# EAGLE design Delay.Chorus PT2399 MAIN v1.1 (EAGLE 7.7.0)
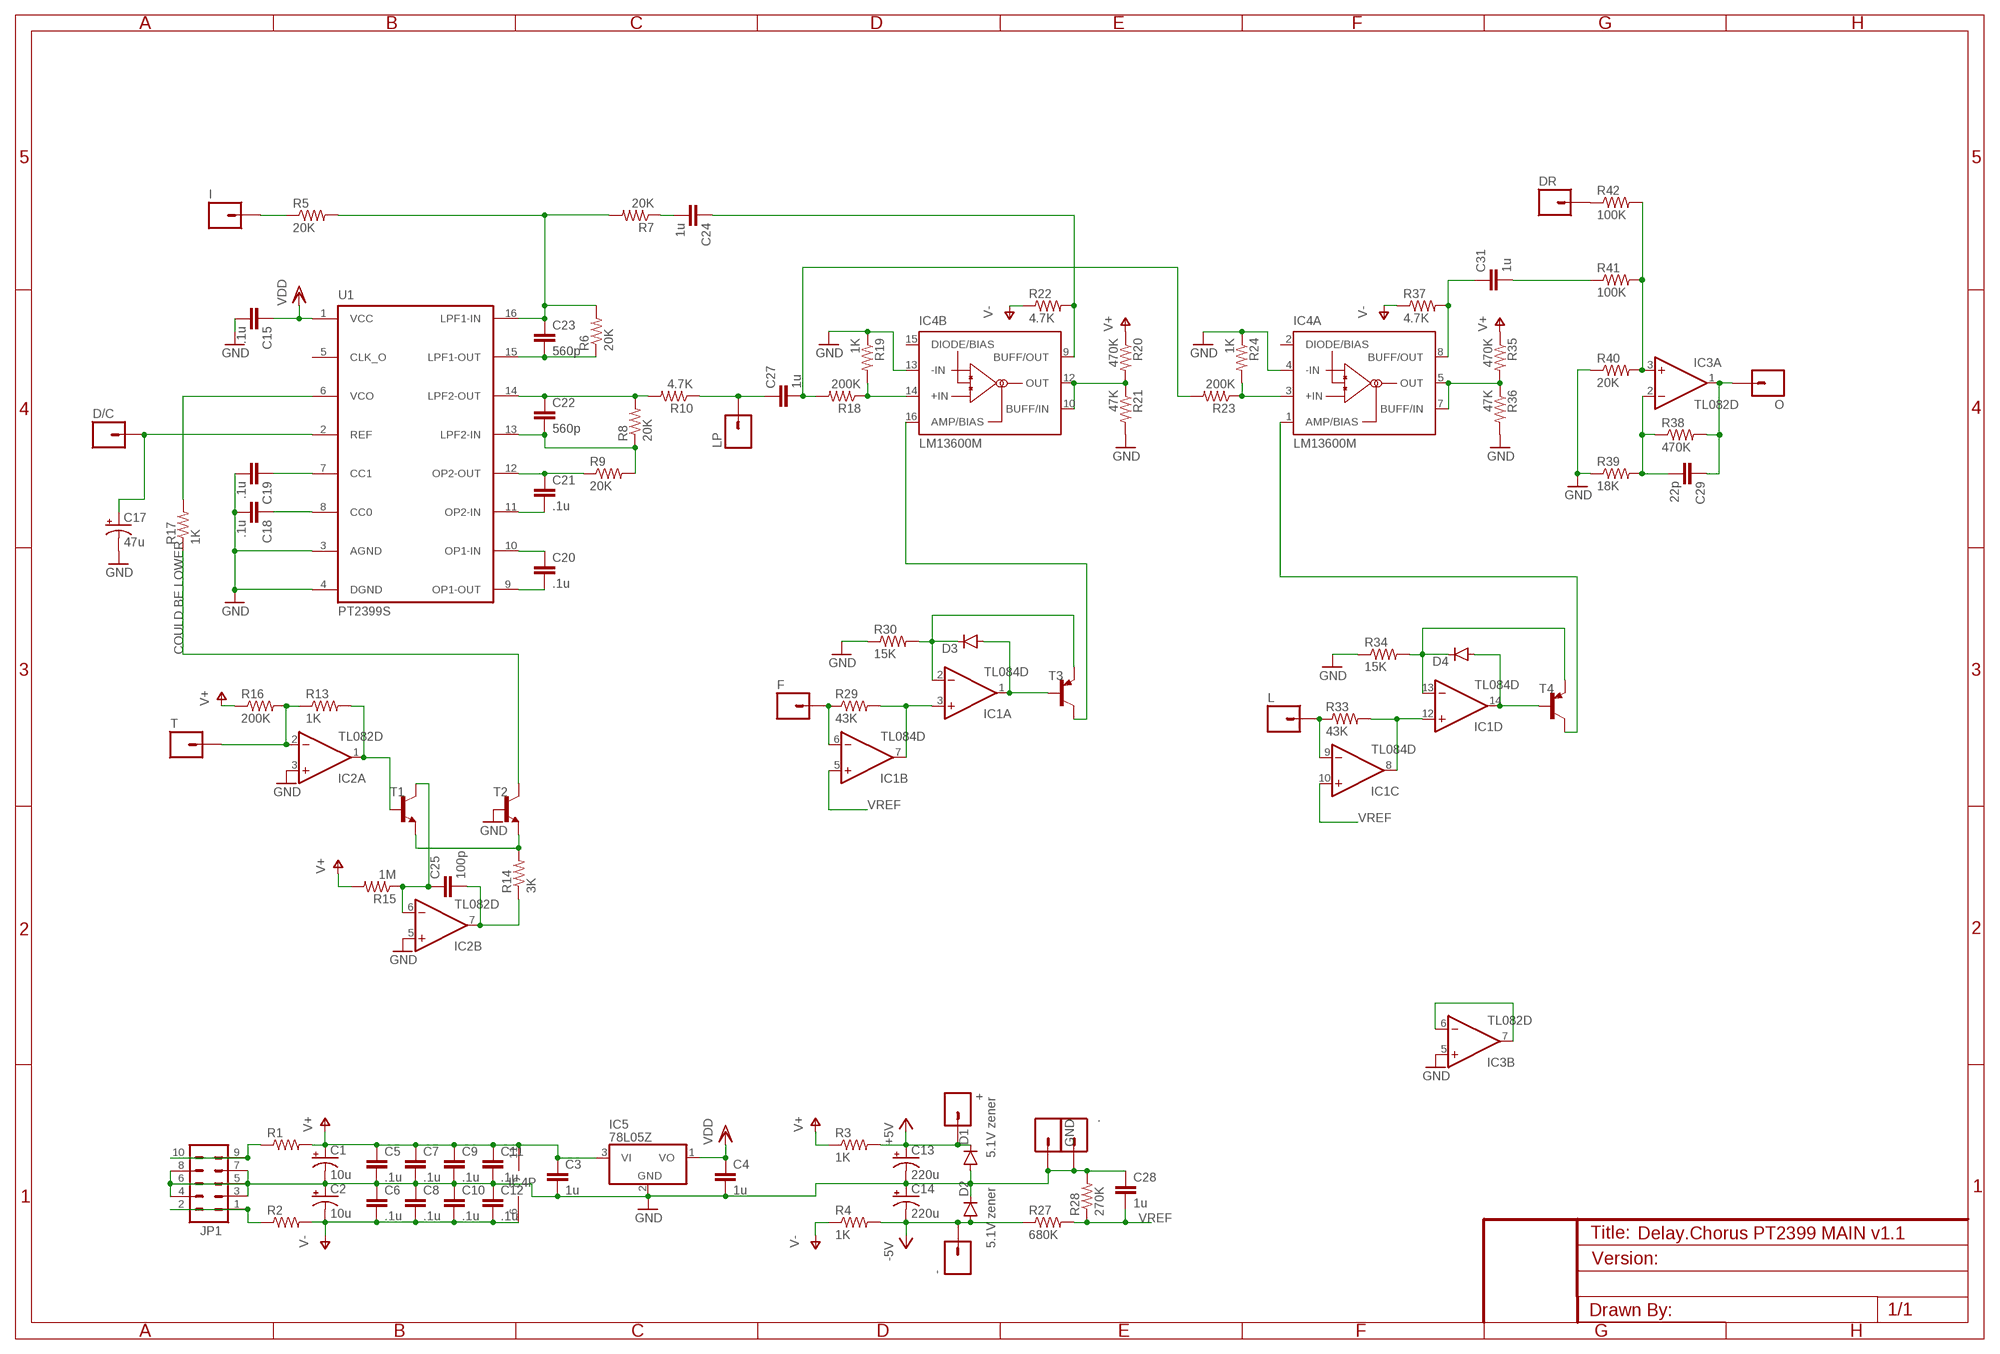
[diagram p0: schematic, sheet 1]

## Parts
+  M01PTH  [1X01]
-  M01PTH  [1X01]
.  M01PTH  [1X01]
C1  10u  CAP_POLPTH2  [CPOL-RADIAL-10UF-25V]
C2  10u  CAP_POLPTH2  [CPOL-RADIAL-10UF-25V]
C3  1u  CAP0805  [0805]
C4  1u  CAP0805  [0805]
C5  .1u  CAP0805  [0805]
C6  .1u  CAP0805  [0805]
C7  .1u  CAP0805  [0805]
C8  .1u  CAP0805  [0805]
C9  .1u  CAP0805  [0805]
C10  .1u  CAP0805  [0805]
C11  .1u  CAP0805  [0805]
C12  .1u  CAP0805  [0805]
C13  220u  CPOL-USE2.5-5  [E2,5-5]
C14  220u  CPOL-USE2.5-5  [E2,5-5]
C15  .1u  CAP0805  [0805]
C17  47u  CPOL-USE2.5-5  [E2,5-5]
C18  .1u  CAP0805  [0805]
C19  .1u  CAP0805  [0805]
C20  .1u  CAP0805  [0805]
C21  .1u  CAP0805  [0805]
C22  560p  CAP0805  [0805]
C23  560p  CAP0805  [0805]
C24  1u  CAP0805  [0805]
C25  100p  CAP0805  [0805]
C27  1u  CAP0805  [0805]
C28  1u  CAP0805  [0805]
C29  22p  CAP0805  [0805]
C31  1u  CAP0805  [0805]
D1  5.1V zener  DIODESOD123  [SOD-123]
D2  5.1V zener  DIODESOD123  [SOD-123]
D3  DIODESOD123  [SOD-123]
D4  DIODESOD123  [SOD-123]
D/C  M01PTH  [1X01]
DR  M01PTH  [1X01]
F  M01PTH  [1X01]
GND  M01PTH  [1X01]
I  M01PTH  [1X01]
IC1  TL084D  [SO14]
IC2  TL082D  [SO08]
IC3  TL082D  [SO08]
IC4  LM13600M  [SO16]
IC5  78L05Z  [TO92]
JP1  M05X2PTH  [AVR_ICSP]
L  M01PTH  [1X01]
LP  M01PTH  [1X01]
O  M01PTH  [1X01]
R1  RESISTOR0805-RES  [0805]
R2  RESISTOR0805-RES  [0805]
R3  1K  RESISTOR0805-RES  [0805]
R4  1K  RESISTOR0805-RES  [0805]
R5  20K  RESISTOR0805-RES  [0805]
R6  20K  RESISTOR0805-RES  [0805]
R7  20K  RESISTOR0805-RES  [0805]
R8  20K  RESISTOR0805-RES  [0805]
R9  20K  RESISTOR0805-RES  [0805]
R10  4.7K  RESISTOR0805-RES  [0805]
R13  1K  RESISTOR0805-RES  [0805]
R14  3K  RESISTOR0805-RES  [0805]
R15  1M  RESISTOR0805-RES  [0805]
R16  200K  RESISTOR0805-RES  [0805]
R17  1K  RESISTOR0805-RES  [0805]
R18  200K  RESISTOR0805-RES  [0805]
R19  1K  RESISTOR0805-RES  [0805]
R20  470K  RESISTOR0805-RES  [0805]
R21  47K  RESISTOR0805-RES  [0805]
R22  4.7K  RESISTOR0805-RES  [0805]
R23  200K  RESISTOR0805-RES  [0805]
R24  1K  RESISTOR0805-RES  [0805]
R27  680K  RESISTOR0805-RES  [0805]
R28  270K  RESISTOR0805-RES  [0805]
R29  43K  RESISTOR0805-RES  [0805]
R30  15K  RESISTOR0805-RES  [0805]
R33  43K  RESISTOR0805-RES  [0805]
R34  15K  RESISTOR0805-RES  [0805]
R35  470K  RESISTOR0805-RES  [0805]
R36  47K  RESISTOR0805-RES  [0805]
R37  4.7K  RESISTOR0805-RES  [0805]
R38  470K  RESISTOR0805-RES  [0805]
R39  18K  RESISTOR0805-RES  [0805]
R40  20K  RESISTOR0805-RES  [0805]
R41  100K  RESISTOR0805-RES  [0805]
R42  100K  RESISTOR0805-RES  [0805]
T  M01PTH  [1X01]
T1  MMBT3904LT1-NPN-SOT23-BEC  [SOT23-BEC]
T2  MMBT3904LT1-NPN-SOT23-BEC  [SOT23-BEC]
T3  MMBT3906LT1-PNP-SOT23-BEC  [SOT23-BEC]
T4  MMBT3906LT1-PNP-SOT23-BEC  [SOT23-BEC]
U1  PT2399S  [SO16W]

## Nets
+5V: +.1 C13.+ D1.C R3.2
-5V: -.1 C14.- D2.A R4.2 R27.1
GND: ..1 C1.2(-) C2.1(+) C3.2 C4.2 C5.2 C6.1 C7.2 C8.1 C9.2 C10.1 C11.2 C12.1 C13.- C14.+ C15.2 C17.- C18.2 C19.2 C28.1 D1.A D2.C GND.1 IC2.3(A:+IN) IC2.5(B:+IN) IC3.5(B:+IN) IC4.4(A:-IN) IC4.13(B:-IN) IC5.2(GND) JP1.3 JP1.4 JP1.5 JP1.6 JP1.7 JP1.8 R19.1 R21.2 R24.1 R28.2 R30.1 R34.1 R36.2 R39.1 R40.1 T2.B U1.3(AGND) U1.4(DGND)
N$1: C17.+ D/C.1 U1.2(REF)
N$2: C19.1 U1.7(CC1)
N$3: C18.1 U1.8(CC0)
N$4: C23.1 R5.2 R6.2 R7.2 U1.16(LPF1-IN)
N$5: C22.1 R8.2 R10.2 U1.14(LPF2-OUT)
N$6: C22.2 R8.1 R9.2 U1.13(LPF2-IN)
N$7: C21.1 R9.1 U1.12(OP2-OUT)
N$8: C21.2 U1.11(OP2-IN)
N$9: JP1.1 JP1.2 R2.1
N$10: JP1.9 JP1.10 R1.1
N$11: C20.1 U1.10(OP1-IN)
N$12: C20.2 U1.9(OP1-OUT)
N$13: C23.2 R6.1 U1.15(LPF1-OUT)
N$14: DR.1 R42.1
N$16: I.1 R5.1
N$17: C24.2 R7.1
N$18: C24.1 IC4.9(B:BUFF/OUT) R22.2
N$22: F.1 IC1.6(B:-IN) R29.1
N$23: IC2.2(A:-IN) R13.1 R16.2 T.1
N$24: IC2.1(A:OUT) R13.2 T1.B
N$25: R14.2 T1.E T2.E
N$26: C25.2 IC2.7(B:OUT) R14.1
N$27: C25.1 IC2.6(B:-IN) R15.1 T1.C
N$28: C27.2 R18.2 R23.2
N$29: R17.1 T2.C
N$30: R17.2 U1.6(VCO)
N$31: IC4.14(B:+IN) R18.1 R19.2
N$32: IC4.10(B:BUFF/IN) IC4.12(B:OUT) R20.2 R21.1
N$34: IC4.3(A:+IN) R23.1 R24.2
N$38: IC1.3(A:+IN) IC1.7(B:OUT) R29.2
N$39: D3.C IC1.2(A:-IN) R30.2 T3.E
N$40: D3.A IC1.1(A:OUT) T3.B
N$41: IC4.5(A:OUT) IC4.7(A:BUFF/IN) R35.2 R36.1
N$42: IC4.16(B:AMP/BIAS) T3.C
N$47: IC1.8(C:OUT) IC1.12(D:+IN) R33.2
N$48: D4.C IC1.13(D:-IN) R34.2 T4.E
N$49: D4.A IC1.14(D:OUT) T4.B
N$50: IC4.1(A:AMP/BIAS) T4.C
N$51: C31.1 IC4.8(A:BUFF/OUT) R37.2
N$52: C29.2 IC3.2(A:-IN) R38.1 R39.2
N$53: C29.1 IC3.1(A:OUT) O.1 R38.2
N$54: IC1.9(C:-IN) L.1 R33.1
N$55: IC3.3(A:+IN) R40.2 R41.2 R42.2
N$56: C31.2 R41.1
N$59: IC3.6(B:-IN) IC3.7(B:OUT)
N$62: C27.1 LP.1 R10.1
V+: C1.1(+) C3.1 C5.1 C7.1 C9.1 C11.1 IC4.11(P:V+) IC5.3(VI) R1.2 R3.1 R15.2 R16.1 R20.1 R35.1
V-: C2.2(-) C6.2 C8.2 C10.2 C12.2 IC4.6(P:V-) R2.2 R4.1 R22.1 R37.1
VDD: C4.1 C15.1 IC5.1(VO) U1.1(VCC)
VREF: C28.2 IC1.5(B:+IN) IC1.10(C:+IN) R27.2 R28.1
Unconnected: IC4.2(A:DIODE/BIAS) IC4.15(B:DIODE/BIAS) U1.5(CLK_O)

## Notes on the sheet
- COULD BE LOWER

## Power pins joined to a net without a drawn wire
V+: IC1.4(P:V+) IC2.8(P:V+) IC3.8(P:V+)
V-: IC1.11(P:V-) IC2.4(P:V-) IC3.4(P:V-)

## Library data of the parts
+ - . D/C DR F GND I L LP O T = SparkFun-Connectors:M01: Header 1 Standard 1-pin 0.1" header. Use with straight break away headers (SKU : PRT-00116), right angle break away headers (PRT-00553), swiss pins (PRT-00743), machine pins (PRT-00117), and female headers (PRT-00115).
C1 C2 = SparkFun-Capacitors:CAP_POL: Capacitor Polarized These are standard SMD and PTH capacitors. Normally 10uF, 47uF, and 100uF in electrolytic and tantalum varieties. Always verify the external diameter of the through hole cap, it varies with capacity, voltage, and manufacturer. The EIA devices should be standard.
C3-C12 C15 C18-C25 C27-C29 C31 = SparkFun-Capacitors:CAP: Capacitor Standard 0603 ceramic capacitor, and 0.1" leaded capacitor.
C13 C14 C17 = rcl:CPOL-US: POLARIZED CAPACITOR, American symbol
D1-D4 = SparkFun-DiscreteSemi:DIODE: Diode These are standard reverse protection diodes and small signal diodes. SMA package can handle up to about 1A. SOD-323 can handle about 200mA. What the SOD-323 package when ordering, there are some mfgs out there that are 5-pin packages.
IC1 = linear:TL084: OP AMP
IC2 IC3 = linear:TL082: OP AMP Data sheet <http://www.ti.com/lit/ds/symlink/tl084a . pdf>; DATA_SHEET: <a href="http://www.ti.com/lit/ds/symlink/tl084a.pdf"> Data sheet </a>
IC4 = national-semiconductor:LM13600: Dual Operational Transconductance Amplifiers with Linearizing Diodes and Buffers Source: lm13600.PDF
IC5 = linear:78*: Positive VOLTAGE REGULATOR Source: http://cache.national.com/ds/LM/LM78L05.pdf http://www.fairchildsemi.com/ds/LM/LM7805.pdf
JP1 = SparkFun-Connectors:M05X2: Header 5x2 Standard 10-pin dual row 0.1" header. Commonly used with AVR-ISP. Use with Spark Fun Electronics SKU: PRT-00778
R1-R10 R13-R24 R27-R30 R33-R42 = SparkFun-Passives:RESISTOR: Resistor Basic schematic elements and footprints for 0603, 1206, and PTH resistors.
T1 T2 = transistor:*-NPN-: NPN Transistror BF959 corrected 2008.03.06
T3 T4 = transistor:*-PNP-: PNP Transistror
U1 = princeton-tech:PT2399: Echo Processor IC

## Board
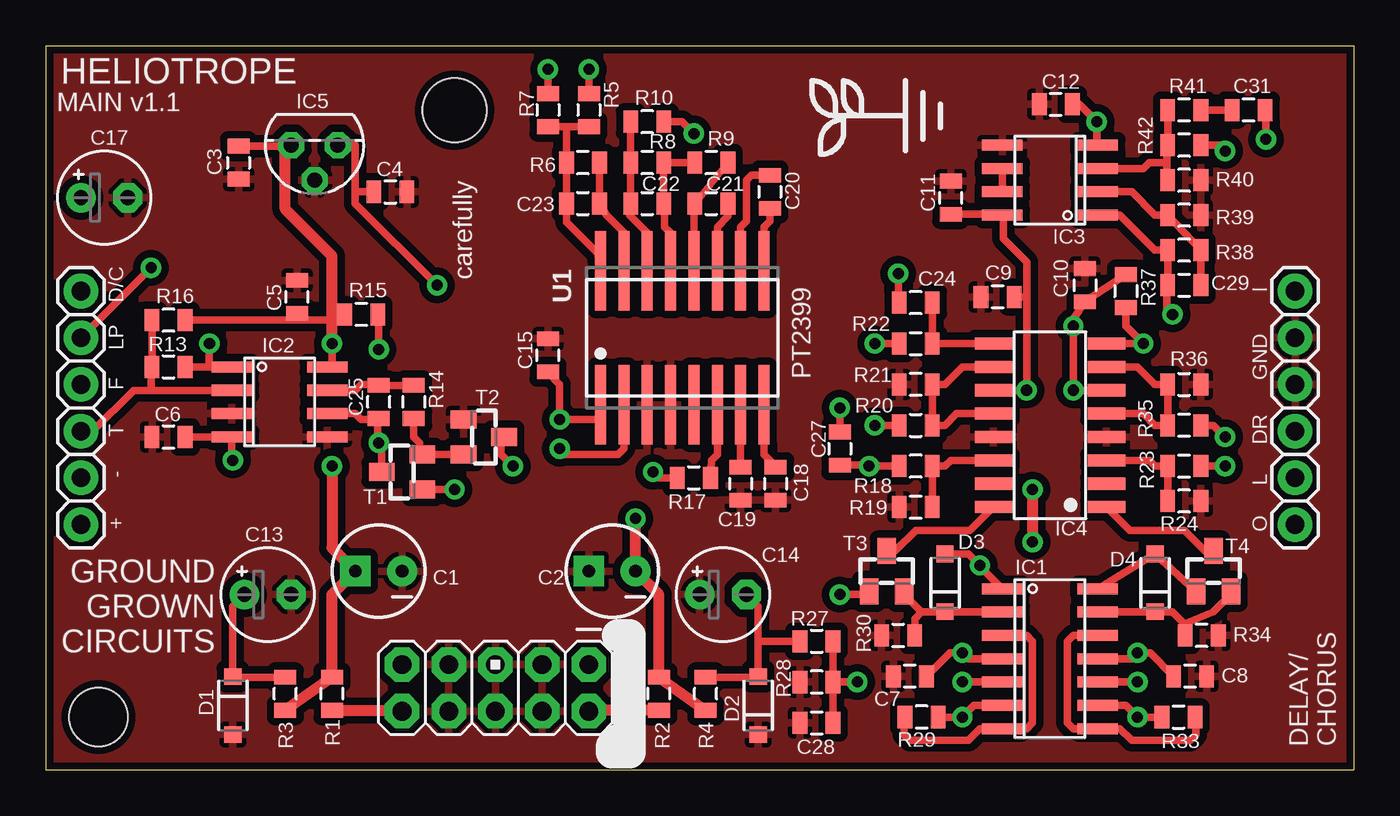
[diagram p1: board, top side]
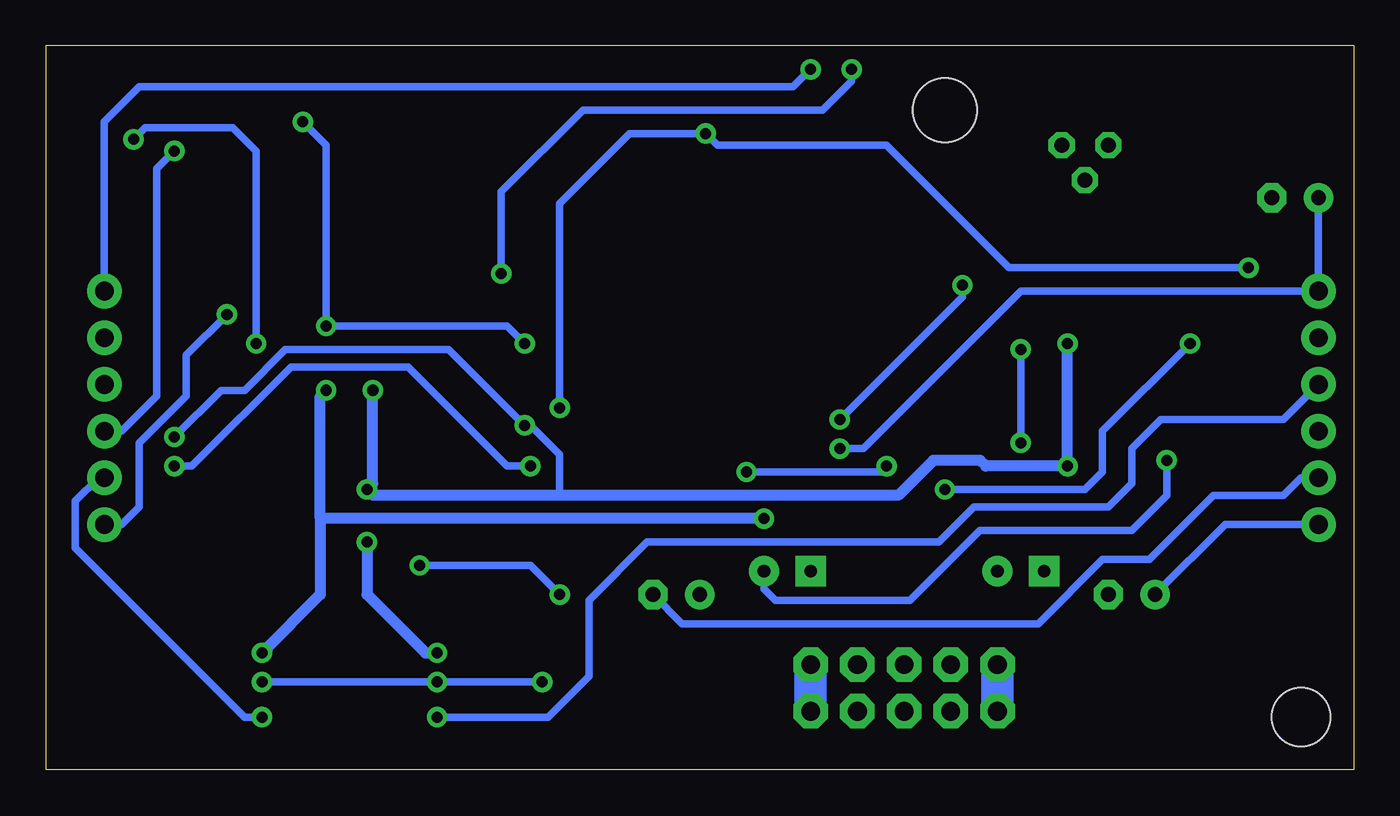
[diagram p2: board, bottom side, seen from below]

Size 71.12 x 39.37 mm. Coordinates in mm from the lower left corner, seen from the top.
Outline: 0,0 71.12,0 71.12,39.37 0,39.37 0,0
Copper layers (1*16): Top 0.035mm / dielectric 1.5mm / Bottom 0.035mm
Design rules "SparkFun": minimum track width 8mil, minimum drill 20mil, track to track 8mil, track to pad 8mil, pad to pad 8mil, via to via 8mil, smd to smd 8mil, copper to edge 8mil, drill to drill 8mil, minimum pad ring 12mil, minimum via ring 10mil, stop-mask expansion 4mil, vias tented up to drill 20mil, thermal gap 10mil
Holes 3.5 mm at 22.23,35.88
Holes 3.2 mm at 2.86,2.86

### Footprints (pad centres in the part's own frame; a part is rotated, then mirrored left to right if it is on the bottom)
1X01 = drill 1.016 pad 1.88: 1 0,0
CPOL-RADIAL-10UF-25V = drill 0.7 pad 1.651 square: 1 1.27,0 | drill 0.7 pad 1.651: 2 -1.27,0
0805 = smd 0.8 x 1.2: 1 -0.9,0; 2 0.9,0
E2,5-5 = drill 0.813 pad 1.6: + -1.27,0 | drill 0.813 pad 1.6 octagon: - 1.27,0
SOD-123 = smd 0.9 x 0.95: A 1.575,0; C -1.575,0
SO14 = smd 0.6 x 2.2: 1 -3.81,-2.6; 2 -2.54,-2.6; 3 -1.27,-2.6; 4 0,-2.6; 5 1.27,-2.6; 6 2.54,-2.6; 7 3.81,-2.6; 8 3.81,2.6; 9 2.54,2.6; 10 1.27,2.6; 11 0,2.6; 12 -1.27,2.6; 13 -2.54,2.6; 14 -3.81,2.6
SO08 = smd 0.6 x 2.2: 1 -1.905,-2.6; 2 -0.635,-2.6; 3 0.635,-2.6; 4 1.905,-2.6; 5 1.905,2.6; 6 0.635,2.6; 7 -0.635,2.6; 8 -1.905,2.6
SO16 = smd 0.66 x 2.032: 1 -4.445,-3.073; 2 -3.175,-3.073; 3 -1.905,-3.073; 4 -0.635,-3.073; 5 0.635,-3.073; 6 1.905,-3.073; 7 3.175,-3.073; 8 4.445,-3.073; 9 4.445,3.073; 10 3.175,3.073; 11 1.905,3.073; 12 0.635,3.073; 13 -0.635,3.073; 14 -1.905,3.073; 15 -3.175,3.073; 16 -4.445,3.073
TO92 = drill 0.813 octagon: 1 -1.27,0; 2 0,1.905; 3 1.27,0
AVR_ICSP = drill 1.016 pad 1.88 octagon: 1 -1.27,5.08; 2 1.27,5.08; 3 -1.27,2.54; 4 1.27,2.54; 5 -1.27,0; 6 1.27,0; 7 -1.27,-2.54; 8 1.27,-2.54; 9 -1.27,-5.08; 10 1.27,-5.08
SOT23-BEC = smd 1 x 1.4: B -0.95,-1.1; C 0,1.1; E 0.95,-1.1
SO16W = smd 0.6 x 4.318: 1 -4.445,-3.647; 2 -3.175,-3.647; 3 -1.905,-3.647; 4 -0.635,-3.647; 5 0.635,-3.647; 6 1.905,-3.647; 7 3.175,-3.647; 8 4.445,-3.647; 9 4.445,3.647; 10 3.175,3.647; 11 1.905,3.647; 12 0.635,3.647; 13 -0.635,3.647; 14 -1.905,3.647; 15 -3.175,3.647; 16 -4.445,3.647

### Placement (x,y rotation side)
+  1.91,13.34 270 top
-  1.91,15.88 270 top
.  67.94,23.5 90 top
C1  18.1,10.79 180 top
C2  30.8,10.79 180 top
C3  10.48,33.02 270 top
C4  18.73,31.43 0 top
C5  13.65,25.72 90 top
C6  6.67,18.1 0 top
C7  46.99,5.08 180 top
C8  62.23,5.08 180 top
C9  51.75,25.72 180 top
C10  56.52,26.35 270 top
C11  49.21,31.11 90 top
C12  54.93,36.2 0 top
C13  12.06,9.53 0 top
C14  36.83,9.53 0 top
C15  27.3,22.54 90 top
C17  3.17,31.11 0 top
C18  39.69,15.56 270 top
C19  37.78,15.56 270 top
C20  39.37,31.43 270 top
C21  36.2,30.8 0 top
C22  32.7,30.8 0 top
C23  29.21,30.8 0 top
C24  47.31,25.4 180 top
C25  18.1,20 90 top
C27  43.18,17.46 270 top
C28  41.91,2.54 0 top
C29  61.91,26.35 0 top
C31  65.41,35.88 180 top
D1  10.16,3.49 270 top
D2  38.73,3.49 90 top
D3  48.9,10.16 90 top
D4  60.33,10.16 90 top
D/C  1.91,26.04 270 top
DR  67.94,18.41 90 top
F  1.91,20.95 270 top
GND  67.94,20.95 90 top
I  67.94,26.04 90 top
IC1  54.61,6.03 270 top
IC2  12.7,20 270 top
IC3  54.61,32.07 90 top
IC4  54.61,18.73 90 top
IC5  14.61,33.97 180 top
JP1  24.45,4.45 270 top
L  67.94,15.88 90 top
LP  1.91,23.5 270 top
O  67.94,13.34 90 top
R1  15.56,4.13 90 top
R2  33.34,4.13 90 top
R3  13.02,4.13 90 top
R4  35.88,4.13 90 top
R5  29.53,35.88 270 top
R6  29.21,33.02 180 top
R7  27.3,35.88 270 top
R8  32.7,33.02 180 top
R9  36.2,33.02 180 top
R10  32.7,35.24 180 top
R13  6.67,21.91 0 top
R14  20,20 270 top
R15  17.14,24.77 180 top
R16  6.67,24.45 180 top
R17  35.24,15.88 0 top
R18  47.31,16.51 180 top
R19  47.31,14.29 0 top
R20  47.31,18.73 0 top
R21  47.31,20.95 180 top
R22  47.31,23.18 0 top
R23  61.91,16.51 0 top
R24  61.91,14.61 180 top
R27  41.91,6.99 0 top
R28  41.91,4.76 180 top
R29  47.62,2.86 180 top
R30  46.35,7.3 0 top
R33  61.59,2.86 0 top
R34  62.87,7.3 180 top
R35  61.91,18.73 180 top
R36  61.91,20.95 0 top
R37  58.74,26.04 270 top
R38  61.91,28.26 180 top
R39  61.91,30.16 180 top
R40  61.91,32.07 180 top
R41  61.91,35.88 180 top
R42  61.91,33.97 180 top
T  1.91,18.41 270 top
T1  19.37,16.19 90 top
T2  23.81,18.1 270 top
T3  45.72,10.79 0 top
T4  63.5,10.79 0 top
U1  34.61,23.5 0 top
U$1  [LOGO_SMALL]  46.67,35.56 90 top

### Tracks (layer width: path | path; a pad name or v marks a point on that pad's centre or on a via)
+5V
  Top 0.406: R3.2 10.2,5.03 D1.C 10.16,8.89 C13.+
  Bottom 0.406: +.1 6.99,13.34 C13.+
-5V
  Top 0.406: R4.2 38.7,5.03 D2.A 38.73,6.99 | 38.73,6.99 38.73,8.89 C14.- | R27.1 38.73,6.99
  Bottom 0.406: -.1 2.86,15.88 3.81,14.92 7.62,14.92 11.11,11.43 13.65,11.43 17.14,7.94 36.51,7.94 C14.-
GND
  pour Top (isolate 0.406): 0,0 0,39.37 71.12,39.37 71.12,0
N$1  (via drill 0.6)
  Top 0.406: v27.94,17.46 28.26,17.14 31.11,17.14 31.43,17.46 U1.2
  Bottom 0.406: C17.+ D/C.1 18.1,26.04 26.67,17.46 v27.94,17.46
N$2
  Top 0.406: C19.1 U1.7
N$3
  Top 0.406: C18.1 39.69,16.51 39.05,17.14 U1.8
N$4
  Top 0.406: R5.2 28.26,34.98 | 28.26,34.98 R7.2 | 28.26,34.98 28.31,34.92 R6.2 C23.1 28.31,29.79 30.01,28.09 U1.16
N$5
  Top 0.406: R10.2 R8.2 C22.1 31.75,30.75 31.75,30.16 32.7,29.21 U1.14
N$6
  Top 0.406: R9.2 R8.1 C22.2 33.66,30.75 33.66,29.53 33.97,29.21 U1.13
N$7
  Top 0.406: R9.1 C21.1 35.24,30.75 U1.12
N$8
  Top 0.406: C21.2 37.09,30.11 36.51,29.53 U1.11
N$9
  Top 0.61: R2.1 29.53,3.23 JP1.2
  Bottom 1.778: JP1.1 JP1.2
N$10
  Top 0.61: R1.1 19.37,3.23 JP1.10
  Bottom 1.778: JP1.9 JP1.10
N$11
  Top 0.406: C20.1 38.37,32.33 38.1,32.07 38.1,29.84 37.78,29.53 U1.10
N$12
  Top 0.406: C20.2 39.37,29.84 39.05,29.53 U1.9
N$13
  Top 0.406: R6.1 C23.2 30.48,30.16 31.43,29.21 U1.15
N$14  (via drill 0.6)
  Top 0.406: R42.1 63.82,33.97 v64.14,33.66
  Bottom 0.406: v64.14,33.66 65.09,32.7 65.09,20.32 66.99,18.41 DR.1
N$16  (via drill 0.6)
  Top 0.406: v29.53,38.1 R5.1
  Bottom 0.406: I.1 67.94,35.24 66.04,37.15 30.48,37.15 v29.53,38.1
N$17  (via drill 0.6)
  Top 0.406: R7.1 v27.3,38.1 | v46.35,26.99 46.35,25.45 C24.2
  Bottom 0.406: v27.3,38.1 27.3,37.47 28.89,35.88 41.91,35.88 46.35,31.43 v46.35,26.99
N$18
  Top 0.406: IC4.9 R22.2 C24.1
N$22  (via drill 0.6)
  Top 0.406: IC1.6 50.48,3.49 v49.85,2.86 R29.1
  Bottom 0.406: v49.85,2.86 43.81,2.86 41.59,5.08 41.59,9.21 38.42,12.38 22.54,12.38 20.64,14.29 13.34,14.29 12.06,15.56 12.06,17.46 10.48,19.05 3.81,19.05 F.1
N$23
  Top 0.406: IC2.2 5.71,20.64 | 5.71,20.64 5.71,21.86 R13.1 R16.2 | T.1 2.54,18.41 4.76,20.64 5.71,20.64
N$24  (via drill 0.6)
  Top 0.406: R13.2 8.89,21.91 | 8.89,21.91 IC2.1 | T1.B v22.22,15.24 v22.23,15.24 | v8.89,23.18 8.89,21.91
  Bottom 0.406: v22.23,15.24 14.61,15.24 13.65,16.19 13.65,18.41 v8.89,23.18
N$25
  Top 0.406: R14.2 20,18.1 20.32,17.78 20.32,17.29 T1.E T2.E
N$26
  Top 0.406: IC2.7 16.83,20.64 17.14,20.95 18.05,20.95 C25.2 R14.1
N$27  (via drill 0.6)
  Top 0.406: IC2.6 16.83,19.37 17.14,19.05 18.05,19.05 | 18.05,19.05 C25.1 | T1.C 18.27,17.61 v18.1,17.78 18.05,17.83 18.05,19.05 | v18.1,22.86 18.1,24.39 R15.1
  Bottom 0.406: v18.1,17.78 v18.1,22.86
N$28  (via drill 0.6)
  Top 0.406: C27.2 44.72,16.56 v44.77,16.51 R18.2 | v64.14,16.51 R23.2
  Bottom 0.406: v44.77,16.51 46.04,16.51 51.44,21.91 57.78,21.91 63.18,16.51 v64.14,16.51
N$29  (via drill 0.6)
  Top 0.406: R17.1 33.34,15.88 v33.02,16.19 | v25.4,16.51 24.77,17.14 24.77,17.95 T2.C
  Bottom 0.406: v33.02,16.19 25.72,16.19 v25.4,16.51
N$30
  Top 0.406: R17.2 36.2,16.83 36.51,17.14 U1.6
N$31
  Top 0.406: IC4.14 49.21,16.83 48.9,16.51 R18.1 R19.2
N$32
  Top 0.406: IC4.12 49.53,19.37 48.9,18.73 R20.2 R21.1 48.9,20.95 49.85,21.91 IC4.10
N$34
  Top 0.406: IC4.3 60.01,16.83 60.33,16.51 R23.1 R24.2
N$38
  Top 0.406: IC1.3 53.34,7.3 53.66,6.99 53.66,2.54 53.34,2.22 IC1.7 50.8,2.22 50.16,1.59 46.99,1.59 46.67,1.91 46.67,2.81 R29.2
N$39
  Top 0.406: T3.E 46.67,9.53 47.62,8.57 | 47.62,8.57 48.88,8.57 D3.C 52,8.59 IC1.2 | R30.2 47.26,8.2 47.62,8.57
N$40  (via drill 0.6)
  Top 0.406: D3.A 50.18,11.73 v50.8,11.11 50.8,11.05 IC1.1 | v43.18,9.53 44.6,9.53 T3.B
  Bottom 0.406: v50.8,11.11 44.77,11.11 v43.18,9.53
N$41
  Top 0.406: IC4.5 59.69,19.37 60.33,18.73 R35.2 R36.1 60.33,20.95 59.37,21.91 IC4.7
N$42
  Top 0.406: T3.C 46.19,11.89 47.31,13.02 50.27,13.02 IC4.16
N$47
  Top 0.406: R33.2 62.55,2.81 62.55,1.91 62.23,1.59 59.05,1.59 58.42,2.22 IC1.8 55.88,2.22 55.56,2.54 55.56,6.99 55.88,7.3 IC1.12
N$48
  Top 0.406: IC1.13 60.31,8.57 D4.C 60.34,8.57 61.28,8.57 61.91,7.94 | R34.2 61.97,7.88 61.91,7.94 | T4.E 64.45,9.52 63.5,8.57 61.91,7.94
N$49
  Top 0.406: T4.B D4.A IC1.14
N$50
  Top 0.406: T4.C 63.03,11.89 61.91,13.02 58.95,13.02 IC4.1
N$51  (via drill 0.6)
  Top 0.406: IC4.8 v59.69,23.18 58.74,24.13 R37.2 | v66.36,34.29 66.36,35.83 C31.1
  Bottom 0.406: v59.69,23.18 59.69,33.66 60.96,34.92 65.72,34.92 v66.36,34.29
N$52
  Top 0.406: IC3.2 59.05,31.43 60.33,30.16 R39.2 R38.1 C29.2
N$53  (via drill 0.6)
  Top 0.406: IC3.1 58.42,30.16 60.33,28.26 R38.2 C29.1 60.96,26.3 60.96,25.08 v61.28,24.77
  Bottom 0.406: O.1 66.99,13.34 66.04,14.29 66.04,17.78 63.5,20.32 63.5,22.54 v61.28,24.77
N$54  (via drill 0.6)
  Top 0.406: R33.1 v59.37,2.86 58.74,3.49 IC1.9
  Bottom 0.406: L.1 68.26,15.88 69.53,14.61 69.53,12.06 60.33,2.86 v59.37,2.86
N$55
  Top 0.406: IC3.3 59.69,32.7 60.01,33.02 60.96,33.02 | 60.96,33.02 60.96,32.12 R40.2 | 60.96,33.02 60.96,33.92 R42.2 R41.2
N$56
  Top 0.406: R41.1 C31.2
N$59
  Top 0.406: IC3.6 IC3.7
N$62  (via drill 0.6)
  Top 0.406: LP.1 v5.71,27.3 | R10.1 34.61,35.24 v35.24,34.61 | v43.18,19.68 C27.1
  Bottom 0.406: v43.18,19.68 43.18,30.8 39.37,34.61 v35.24,34.61 34.61,33.97 25.4,33.97 18.73,27.3 v5.71,27.3
V+  (via drill 0.6)
  Top 0.406: IC2.8 15.56,22.16 v15.56,23.18 | R16.1 13.65,24.45 | C5.1 13.65,24.45 | 13.65,24.45 15.56,24.45 | R15.2 15.56,24.77 | C3.1 13.28,33.92 IC5.3 | IC1.4 50.16,6.03 v49.85,6.35 49.16,6.35 C7.1 | IC4.11 v53.34,20.64 53.34,25.72 | R20.1 v45.09,18.73 | 53.34,25.72 53.34,27.62 52.07,28.89 52.07,30.1 IC3.8 51.96,30.21 C11.1 | C9.1 53.34,25.72 | R35.1 63.5,18.73 v64.14,18.1
  Top 0.61: R3.1 R1.2 15.56,9.53 C1.1 15.56,12.06 v15.56,16.51 | v15.56,23.18 15.56,24.45 15.56,24.77 15.56,27.94 13.02,30.48 13.02,33.66 IC5.3 | v53.66,15.24 v53.66,12.38
  Bottom 0.406: 43.18,14.92 43.18,17.14 44.77,18.73 v45.09,18.73 49.21,22.86 58.1,22.86 60.33,20.64 61.59,20.64 v64.14,18.1
  Bottom 0.61: v53.66,12.38 53.66,9.53 50.48,6.35 v49.85,6.35 | v53.34,20.64 53.34,15.56 v53.66,15.24 53.34,14.92 43.18,14.92 24.77,14.92 22.86,16.83 20.32,16.83 20,16.51 v15.56,16.51 v15.56,23.18
V-  (via drill 0.6)
  Top 0.406: C6.2 IC2.4 10.1,16.89 v10.16,16.83 | IC1.11 59.05,6.03 v59.37,6.35 60.06,6.35 C8.2 | IC4.6 v55.88,20.64 v55.88,24.13 55.88,24.5 C10.2 R37.1 | IC3.4 57.15,34.03 v57.15,35.24 56.2,36.2 C12.2 | R22.1 v45.09,23.18
  Top 0.61: R4.1 R2.2 33.34,9.53 C2.2 v32.07,13.65
  Bottom 0.406: v10.16,16.83 10.16,14.92 12.06,13.02 20.32,13.02 24.13,9.21 31.43,9.21 32.07,9.84 C2.2 | v57.15,35.24 55.88,33.97 v55.88,24.13 46.04,24.13 v45.09,23.18
  Bottom 0.61: v32.07,13.65 56.2,13.65 | 56.2,13.65 56.2,9.53 v59.37,6.35 | 56.2,13.65 56.2,20.32 v55.88,20.64
VDD  (via drill 0.6)
  Top 0.406: IC5.1 16.83,33.97 16.83,31.43 | v21.27,26.35 16.83,30.8 16.83,31.43 | U1.1 30.01,19.05 v27.94,19.05 27.94,20.95 27.3,21.59 C15.1 | C4.1 16.83,31.43
  Bottom 0.406: v21.27,26.35 21.27,25.72 v27.94,19.05
VREF  (via drill 0.6)
  Top 0.406: R27.2 R28.1 | R28.1 C28.2 | R28.1 v44.13,4.76 | v49.85,4.76 IC1.5 | IC1.10 v59.37,4.76
  Bottom 0.406: v44.13,4.76 v49.85,4.76 v59.37,4.76

### Text on the board
tPlace: HELIOTROPE | MAIN v1.1 | carefully | PT2399 | GROUND / GROWN / CIRCUITS | DELAY/ / CHORUS